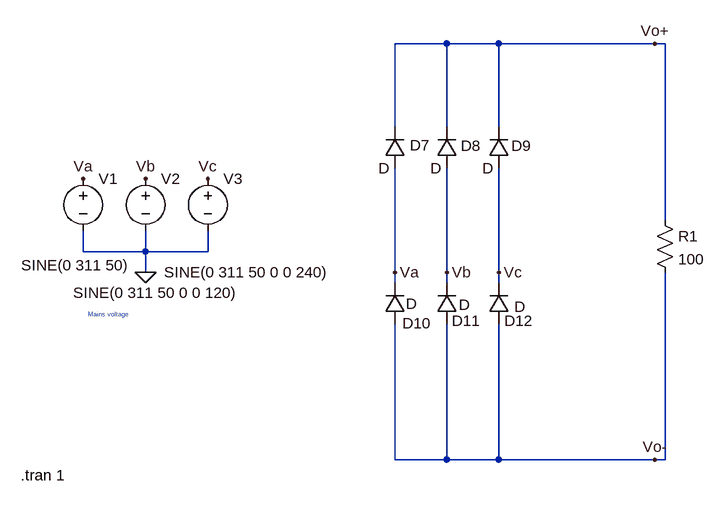
[diagram p0: schematic 3phaseRectifier.asc]
3phaseRectifier.asc, the LTspice schematic file:
Version 4
SHEET 1 3872 1864
WIRE 288 16 208 16
WIRE 368 16 288 16
WIRE 608 16 368 16
WIRE 624 16 608 16
WIRE 208 144 208 16
WIRE 288 144 288 16
WIRE 368 144 368 16
WIRE 624 288 624 16
WIRE -272 336 -272 304
WIRE -176 336 -176 304
WIRE -176 336 -272 336
WIRE -80 336 -80 304
WIRE -80 336 -176 336
WIRE -176 368 -176 336
WIRE 208 368 208 208
WIRE 288 368 288 208
WIRE 368 368 368 208
WIRE 208 384 208 368
WIRE 288 384 288 368
WIRE 368 384 368 368
WIRE 208 656 208 448
WIRE 288 656 288 448
WIRE 288 656 208 656
WIRE 368 656 368 448
WIRE 368 656 288 656
WIRE 608 656 368 656
WIRE 624 656 624 368
WIRE 624 656 608 656
FLAG -272 224 Va
FLAG -176 224 Vb
FLAG -80 224 Vc
FLAG 208 368 Va
FLAG 288 368 Vb
FLAG 368 368 Vc
FLAG -176 368 0
FLAG 608 16 Vo+
FLAG 608 656 Vo-
SYMBOL voltage -272 208 R0
WINDOW 3 -95 149 Left 2
WINDOW 123 0 0 Left 2
WINDOW 39 0 0 Left 2
SYMATTR Value SINE(0 311 50)
SYMATTR InstName V1
SYMBOL voltage -176 208 R0
WINDOW 3 -111 191 Left 2
WINDOW 123 0 0 Left 2
WINDOW 39 0 0 Left 2
SYMATTR Value SINE(0 311 50 0 0 120)
SYMATTR InstName V2
SYMBOL voltage -80 208 R0
WINDOW 3 -67 160 Left 2
WINDOW 123 0 0 Left 2
WINDOW 39 0 0 Left 2
SYMATTR Value SINE(0 311 50 0 0 240)
SYMATTR InstName V3
SYMBOL diode 224 208 R180
WINDOW 0 -38 36 Left 2
WINDOW 3 24 0 Left 2
SYMATTR InstName D7
SYMBOL diode 304 208 R180
WINDOW 0 -36 35 Left 2
WINDOW 3 24 0 Left 2
SYMATTR InstName D8
SYMBOL diode 384 208 R180
WINDOW 0 -34 35 Left 2
WINDOW 3 24 0 Left 2
SYMATTR InstName D9
SYMBOL diode 224 448 R180
WINDOW 0 -40 2 Left 2
WINDOW 3 -18 32 Left 2
SYMATTR InstName D10
SYMBOL diode 304 448 R180
WINDOW 0 -36 6 Left 2
WINDOW 3 -20 30 Left 2
SYMATTR InstName D11
SYMBOL diode 384 448 R180
WINDOW 0 -37 6 Left 2
WINDOW 3 -25 27 Left 2
SYMATTR InstName D12
SYMBOL res 608 272 R0
SYMATTR InstName R1
SYMATTR Value 100
TEXT -264 432 Left 0 ;Mains voltage
TEXT -368 680 Left 2 !.tran 1

The netlist it stands for:
* 3phaseRectifier.asc
V1 Va 0 SINE(0 311 50)
V2 Vb 0 SINE(0 311 50 0 0 120)
V3 Vc 0 SINE(0 311 50 0 0 240)
D7 Va Vo+ D
D8 Vb Vo+ D
D9 Vc Vo+ D
D10 Vo- Va D
D11 Vo- Vb D
D12 Vo- Vc D
R1 Vo+ Vo- 100
.model D D
.lib standard.dio
* Mains voltage
.tran 1
.backanno
.end